# EAGLE design left_revision1_0 (EAGLE 7.2.0)
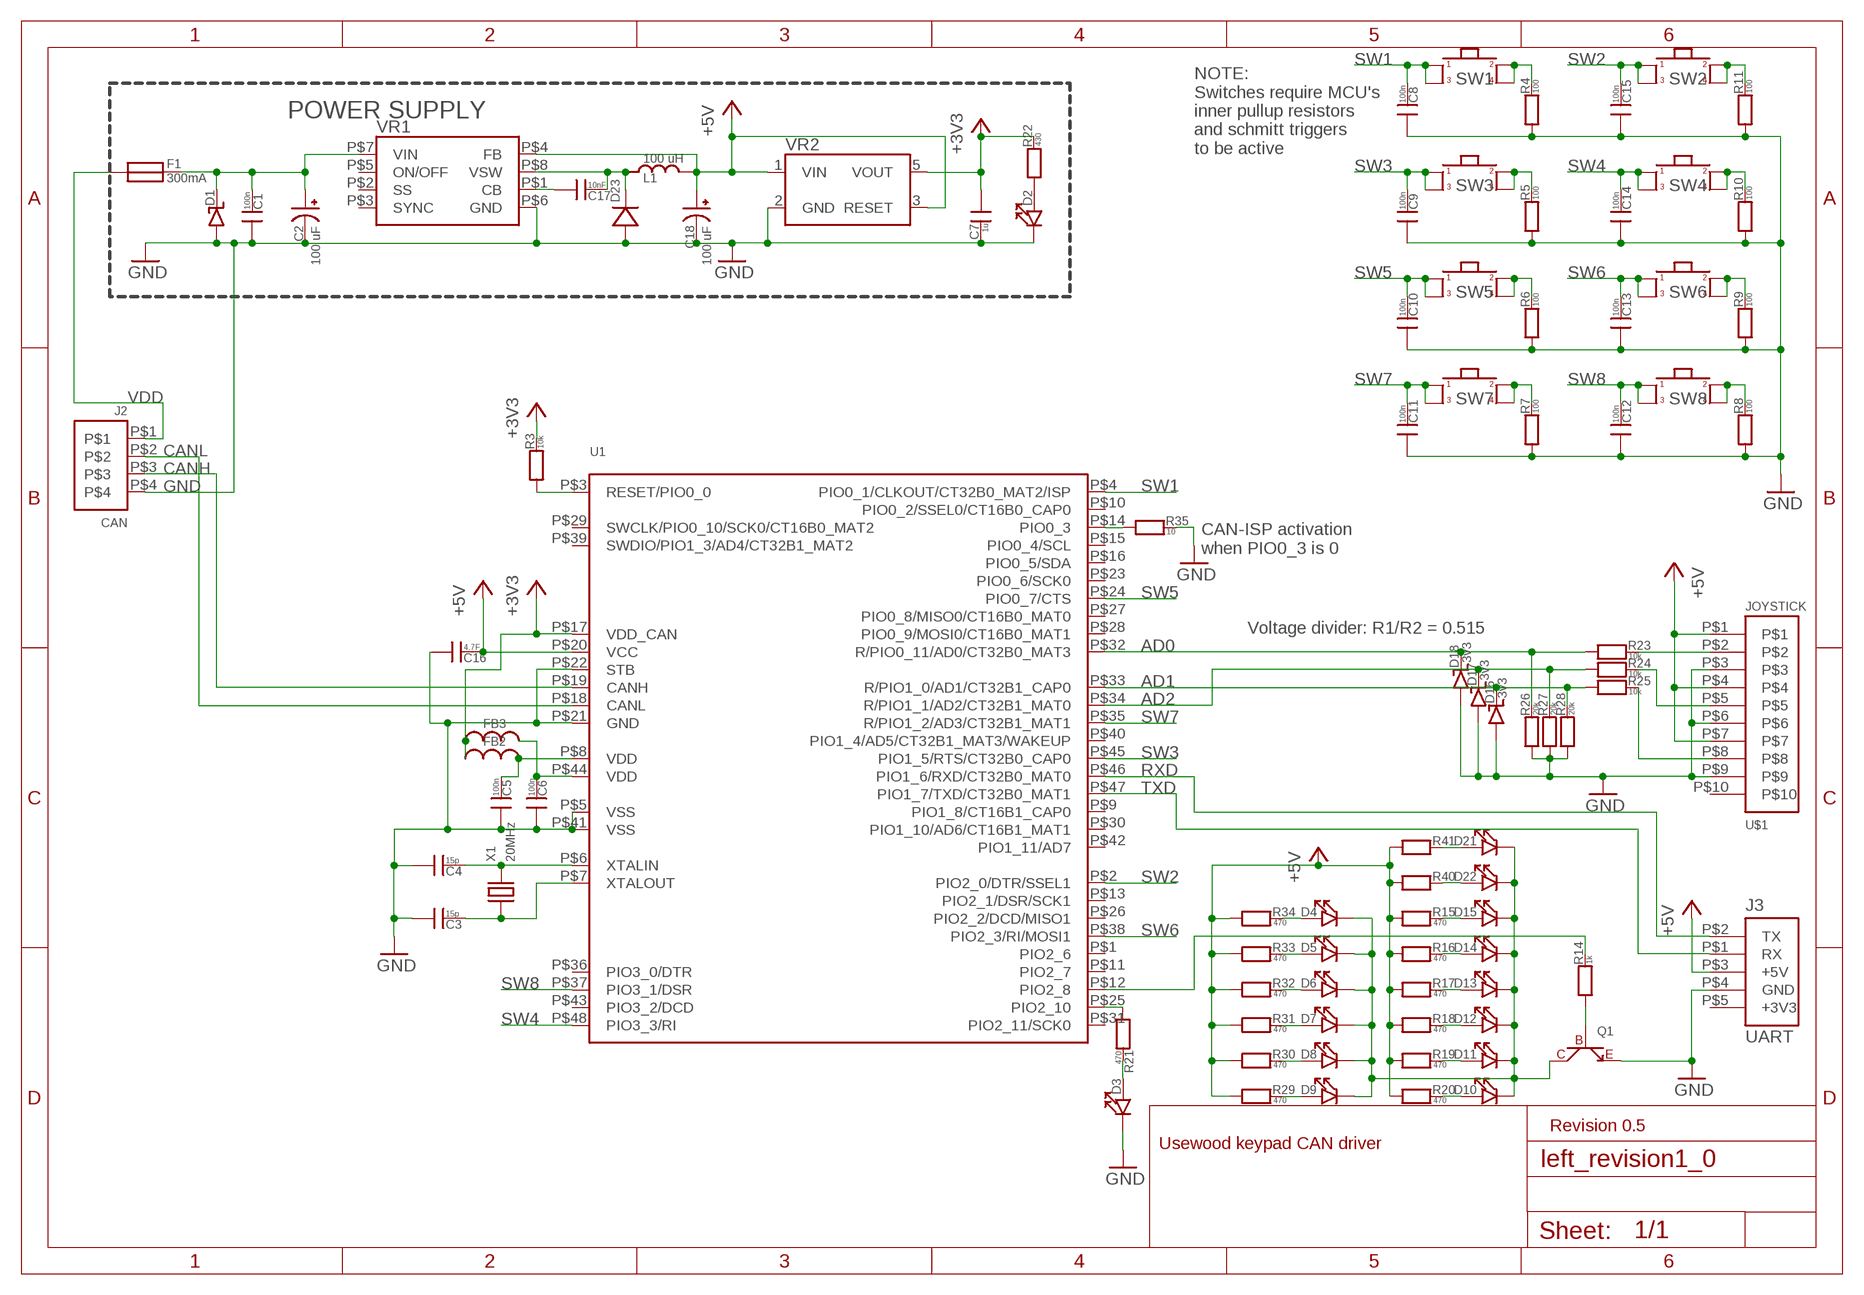
[diagram p0: schematic, sheet 1]

## Parts
C1  100n  CAP0603_SILKSCREEN  [0603_SILKSCREEN]
C2  100 uF  CAP_POLSMD_10X10X10MM  [CAP_POL_SMD_10X10X10MM]
C3  15p  CAP0603_SILKSCREEN  [0603_SILKSCREEN]
C4  15p  CAP0603_SILKSCREEN  [0603_SILKSCREEN]
C5  100n  CAP0603_SILKSCREEN  [0603_SILKSCREEN]
C6  100n  CAP0603_SILKSCREEN  [0603_SILKSCREEN]
C7  1u  CAP0603_SILKSCREEN  [0603_SILKSCREEN]
C8  100n  CAP0603_SILKSCREEN  [0603_SILKSCREEN]
C9  100n  CAP0603_SILKSCREEN  [0603_SILKSCREEN]
C10  100n  CAP0603_SILKSCREEN  [0603_SILKSCREEN]
C11  100n  CAP0603_SILKSCREEN  [0603_SILKSCREEN]
C12  100n  CAP0603_SILKSCREEN  [0603_SILKSCREEN]
C13  100n  CAP0603_SILKSCREEN  [0603_SILKSCREEN]
C14  100n  CAP0603_SILKSCREEN  [0603_SILKSCREEN]
C15  100n  CAP0603_SILKSCREEN  [0603_SILKSCREEN]
C16  4.7F  CAP0603_SILKSCREEN  [0603_SILKSCREEN]
C17  10nF  CAP0603_SILKSCREEN  [0603_SILKSCREEN]
C18  100 uF  CAP_POLSMD_10X10X10MM  [CAP_POL_SMD_10X10X10MM]
D1  DIODE_TVSDO-214AA  [DO-214AB]
D2  LED0603_SILKSCREEN  [0603_SILKSCREEN]
D3  LED0603_SILKSCREEN  [0603_SILKSCREEN]
D4  LED0603_SILKSCREEN  [0603_SILKSCREEN]
D5  LED0603_SILKSCREEN  [0603_SILKSCREEN]
D6  LED0603_SILKSCREEN  [0603_SILKSCREEN]
D7  LED0603_SILKSCREEN  [0603_SILKSCREEN]
D8  LED0603_SILKSCREEN  [0603_SILKSCREEN]
D9  LED0603_SILKSCREEN  [0603_SILKSCREEN]
D10  LED0603_SILKSCREEN  [0603_SILKSCREEN]
D11  LED0603_SILKSCREEN  [0603_SILKSCREEN]
D12  LED0603_SILKSCREEN  [0603_SILKSCREEN]
D13  LED0603_SILKSCREEN  [0603_SILKSCREEN]
D14  LED0603_SILKSCREEN  [0603_SILKSCREEN]
D15  LED0603_SILKSCREEN  [0603_SILKSCREEN]
D16  3v3  DIODE_ZENERSDO123  [SOD123]
D17  3v3  DIODE_ZENERSDO123  [SOD123]
D18  3v3  DIODE_ZENERSDO123  [SOD123]
D21  LED0603_SILKSCREEN  [0603_SILKSCREEN]
D22  LED0603_SILKSCREEN  [0603_SILKSCREEN]
D23  DIODEDO219AB  [DO219AB]
F1  300mA  FUSE100MA  [FUSE_100MA]
FB2  FERRITE0603_SILKSCREEN  [0603_SILKSCREEN]
FB3  FERRITE0603_SILKSCREEN  [0603_SILKSCREEN]
J2  CAN  MOLEX_MICRO-FIT_4WAYTH  [MOLEX_MICRO-FIT_4WAY]
J3  UART  HEADER_USARTTH  [HEADER5_1]
L1  100 uH  INDUCTORBOURNS_10X13X5MM  [INDUCTOR_BOURNS_10X13X5MM]
Q1  NPN_TRANSISTORSOT323  [SOT323]
R3  10k  RES0604_SILKSCREEN  [0603_SILKSCREEN]
R4  100  RES0604_SILKSCREEN  [0603_SILKSCREEN]
R5  100  RES0604_SILKSCREEN  [0603_SILKSCREEN]
R6  100  RES0604_SILKSCREEN  [0603_SILKSCREEN]
R7  100  RES0604_SILKSCREEN  [0603_SILKSCREEN]
R8  100  RES0604_SILKSCREEN  [0603_SILKSCREEN]
R9  100  RES0604_SILKSCREEN  [0603_SILKSCREEN]
R10  100  RES0604_SILKSCREEN  [0603_SILKSCREEN]
R11  100  RES0604_SILKSCREEN  [0603_SILKSCREEN]
R14  1k  RES0604_SILKSCREEN  [0603_SILKSCREEN]
R15  470  RES0604_SILKSCREEN  [0603_SILKSCREEN]
R16  470  RES0604_SILKSCREEN  [0603_SILKSCREEN]
R17  470  RES0604_SILKSCREEN  [0603_SILKSCREEN]
R18  470  RES0604_SILKSCREEN  [0603_SILKSCREEN]
R19  470  RES0604_SILKSCREEN  [0603_SILKSCREEN]
R20  470  RES0604_SILKSCREEN  [0603_SILKSCREEN]
R21  470  RES0604_SILKSCREEN  [0603_SILKSCREEN]
R22  430  RES0604_SILKSCREEN  [0603_SILKSCREEN]
R23  10k  RES0604_SILKSCREEN  [0603_SILKSCREEN]
R24  10k  RES0604_SILKSCREEN  [0603_SILKSCREEN]
R25  10k  RES0604_SILKSCREEN  [0603_SILKSCREEN]
R26  20k  RES0604_SILKSCREEN  [0603_SILKSCREEN]
R27  20k  RES0604_SILKSCREEN  [0603_SILKSCREEN]
R28  20k  RES0604_SILKSCREEN  [0603_SILKSCREEN]
R29  470  RES0604_SILKSCREEN  [0603_SILKSCREEN]
R30  470  RES0604_SILKSCREEN  [0603_SILKSCREEN]
R31  470  RES0604_SILKSCREEN  [0603_SILKSCREEN]
R32  470  RES0604_SILKSCREEN  [0603_SILKSCREEN]
R33  470  RES0604_SILKSCREEN  [0603_SILKSCREEN]
R34  470  RES0604_SILKSCREEN  [0603_SILKSCREEN]
R35  10  RES0604_SILKSCREEN  [0603_SILKSCREEN]
R40  RES0604_SILKSCREEN  [0603_SILKSCREEN]
R41  RES0604_SILKSCREEN  [0603_SILKSCREEN]
SW1  SWITCH12X12MM_CENTER_HOLE  [SWITCH_12X12MM_CENTER_HOLE]
SW2  SWITCH12X12MM_CENTER_HOLE  [SWITCH_12X12MM_CENTER_HOLE]
SW3  SWITCH12X12MM_CENTER_HOLE  [SWITCH_12X12MM_CENTER_HOLE]
SW4  SWITCH12X12MM_CENTER_HOLE  [SWITCH_12X12MM_CENTER_HOLE]
SW5  SWITCH12X12MM_CENTER_HOLE  [SWITCH_12X12MM_CENTER_HOLE]
SW6  SWITCH12X12MM_CENTER_HOLE  [SWITCH_12X12MM_CENTER_HOLE]
SW7  SWITCH12X12MM_CENTER_HOLE  [SWITCH_12X12MM_CENTER_HOLE]
SW8  SWITCH12X12MM_CENTER_HOLE  [SWITCH_12X12MM_CENTER_HOLE]
U1  LPC11C22QFP48  [QFP48]
U$1  JOYSTICK  MOLEX_MICRO-FIT_10WAYTH  [MOLEX-MICRO-FIT_10WAY]
VR1  LM2671SOIC8  [SOIC8]
VR2  LP2985SOP5  [SOP5]
X1  20MHz  XTALSMD_5X3.2  [XTAL_SMD_5X3.2]

## Nets
+3V3: C7.0 FB2.0 FB3.0 R3.1 R22.1 U1.P$17(VDD_CAN) VR2.5(VOUT)
+5V: C16.1 C18.+ J3.P$3(+5V) L1.P$2 R15.0 R16.0 R17.0 R18.0 R19.0 R20.0 R29.0 R30.0 R31.0 R32.0 R33.0 R34.0 R40.0 R41.0 U1.P$20(VCC) U$1.P$1 U$1.P$4 U$1.P$7 VR1.P$4(FB) VR2.1(VIN) VR2.3(RESET)
AD0: D18.P$2(N) R23.0 R26.1 U1.P$32(R/PIO0_11/AD0/CT32B0_MAT3)
AD1: D16.P$2(N) R25.0 R28.1 U1.P$33(R/PIO1_0/AD1/CT32B1_CAP0)
AD2: D17.P$2(N) R24.0 R27.1 U1.P$34(R/PIO1_1/AD2/CT32B1_MAT0)
CAN_ISP: R35.0 U1.P$14(PIO0_3)
CANH: J2.P$3 U1.P$19(CANH)
CANL: J2.P$2 U1.P$18(CANL)
GND: C1.0 C2.- C3.0 C4.0 C5.0 C6.0 C7.1 C8.0 C9.0 C10.0 C11.0 C12.0 C13.0 C14.0 C15.0 C16.0 C18.- D1.P$1(P) D2.1 D3.1 D16.P$1(P) D17.P$1(P) D18.P$1(P) D23.P$1(P) J2.P$4 J3.P$4(GND) Q1.R(E) R4.0 R5.0 R6.0 R7.0 R8.0 R9.0 R10.0 R11.0 R26.0 R27.0 R28.0 R35.1 U1.P$5(VSS) U1.P$21(GND) U1.P$22(STB) U1.P$41(VSS) U$1.P$3 U$1.P$6 U$1.P$9 VR1.P$6(GND) VR2.2(GND)
LED3: D3.0 R21.1
LED4: D4.0 R34.1
LED5: D5.0 R33.1
LED6: D6.0 R32.1
LED7: D7.0 R31.1
LED8: D8.0 R30.1
LED9: D9.0 R29.1
N$2: C6.1 FB3.1 U1.P$44(VDD)
N$3: D2.0 R22.0
N$4: C1.1 C2.+ D1.P$2(N) F1.P$2 VR1.P$7(VIN)
N$5: R14.1 U1.P$12(PIO2_8)
N$6: R21.0 U1.P$25(PIO2_10)
N$11: C17.1 D23.P$2(N) L1.P$1 VR1.P$8(VSW)
N$12: R4.1 SW1.P$3 SW1.P$4
N$13: R5.1 SW3.P$3 SW3.P$4
N$14: R6.1 SW5.P$3 SW5.P$4
N$15: R11.1 SW2.P$3 SW2.P$4
N$16: R9.1 SW6.P$3 SW6.P$4
N$17: R10.1 SW4.P$3 SW4.P$4
N$18: R8.1 SW8.P$3 SW8.P$4
N$19: R7.1 SW7.P$3 SW7.P$4
N$20: D15.0 R15.1
N$21: D14.0 R16.1
N$22: D13.0 R17.1
N$23: D12.0 R18.1
N$24: D11.0 R19.1
N$25: D10.0 R20.1
N$26: C5.1 FB2.1 U1.P$8(VDD)
N$29: D21.0 R41.1
N$30: D22.0 R40.1
N$31: D4.1 D5.1 D6.1 D7.1 D8.1 D9.1 D10.1 D11.1 D12.1 D13.1 D14.1 D15.1 D21.1 D22.1 Q1.M(C)
N$32: C17.0 VR1.P$1(CB)
Q1: Q1.L(B) R14.0
RESET: R3.0 U1.P$3(RESET/PIO0_0)
RXD: J3.P$2(TX) U1.P$46(PIO1_6/RXD/CT32B0_MAT0)
SW1: C8.1 SW1.P$1 SW1.P$2 U1.P$4(PIO0_1/CLKOUT/CT32B0_MAT2/ISP)
SW2: C15.1 SW2.P$1 SW2.P$2 U1.P$2(PIO2_0/DTR/SSEL1)
SW3: C9.1 SW3.P$1 SW3.P$2 U1.P$45(PIO1_5/RTS/CT32B0_CAP0)
SW4: C14.1 SW4.P$1 SW4.P$2 U1.P$48(PIO3_3/RI)
SW5: C10.1 SW5.P$1 SW5.P$2 U1.P$24(PIO0_7/CTS)
SW6: C13.1 SW6.P$1 SW6.P$2 U1.P$38(PIO2_3/RI/MOSI1)
SW7: C11.1 SW7.P$1 SW7.P$2 U1.P$35(R/PIO1_2/AD3/CT32B1_MAT1)
SW8: C12.1 SW8.P$1 SW8.P$2 U1.P$37(PIO3_1/DSR)
TXD: J3.P$1(RX) U1.P$47(PIO1_7/TXD/CT32B0_MAT1)
VDD: F1.P$1 J2.P$1
XJOY: R23.1 U$1.P$2
XTALIN: C4.1 U1.P$6(XTALIN) X1.P$2
XTALOUT: C3.1 U1.P$7(XTALOUT) X1.P$1
YJOY: R24.1 U$1.P$5
ZJOY: R25.1 U$1.P$8
Unconnected: J3.P$5(+3V3) U1.P$1(PIO2_6) U1.P$9(PIO1_8/CT16B1_CAP0) U1.P$10(PIO0_2/SSEL0/CT16B0_CAP0) U1.P$11(PIO2_7) U1.P$13(PIO2_1/DSR/SCK1) U1.P$15(PIO0_4/SCL) U1.P$16(PIO0_5/SDA) U1.P$23(PIO0_6/SCK0) U1.P$26(PIO2_2/DCD/MISO1) U1.P$27(PIO0_8/MISO0/CT16B0_MAT0) U1.P$28(PIO0_9/MOSI0/CT16B0_MAT1) U1.P$29(SWCLK/PIO0_10/SCK0/CT16B0_MAT2) U1.P$30(PIO1_10/AD6/CT16B1_MAT1) U1.P$31(PIO2_11/SCK0) U1.P$36(PIO3_0/DTR) U1.P$39(SWDIO/PIO1_3/AD4/CT32B1_MAT2) U1.P$40(PIO1_4/AD5/CT32B1_MAT3/WAKEUP) U1.P$42(PIO1_11/AD7) U1.P$43(PIO3_2/DCD) U$1.P$10 VR1.P$2(SS) VR1.P$3(SYNC) VR1.P$5(ON/OFF)

## Notes on the sheet
- POWER SUPPLY
- NOTE:
  Switches require MCU's
  inner pullup resistors
  and schmitt triggers
  to be active
- CAN-ISP activation 
  when PIO0_3 is 0
- Voltage divider: R1/R2 = 0.515
- Revision 0.5
- Usewood keypad CAN driver

## Library data of the parts
C1 C3-C17 = usevolt:CAP
C2 C18 = usevolt:CAP_POL
D1 = arm:DIODE_TVS
D2-D15 D21 D22 = usevolt:LED
D16-D18 = usevolt:DIODE_ZENER
D23 = usevolt:DIODE
F1 = arm:FUSE
FB2 FB3 = usevolt:FERRITE
J2 = arm:MOLEX_MICRO-FIT_4WAY: MOLEX 43045-0401 HEADER, RIGHT ANGLE, DUAL ROW, 4 WAY, 1704306
J3 = arm:HEADER_USART: USB to USART module header
L1 = usevolt:INDUCTOR
Q1 = usevolt:NPN_TRANSISTOR: http://www.farnell.com/datasheets/1697409.pdf 9294511
R3-R11 R14-R35 R40 R41 = usevolt:RES
SW1-SW8 = arm:SWITCH
U1 = arm:LPC11C22: NXP MCU, 32BIT, CORTEX-M0, 50MHZ, LQFP-48, 2314753
U$1 = usevolt:MOLEX_MICRO-FIT_10WAY: MOLEX HEADER, MICRO-FIT, R/A, DUAL ROW, 10 WAY, 1012255
VR1 = usevolt:LM2671
VR2 = arm:LP2985: TEXAS INSTRUMENTS LP2985IM5-3.3 V REG LDO +3.3V, SMD, 2985, SOT235
X1 = arm:XTAL

## Board
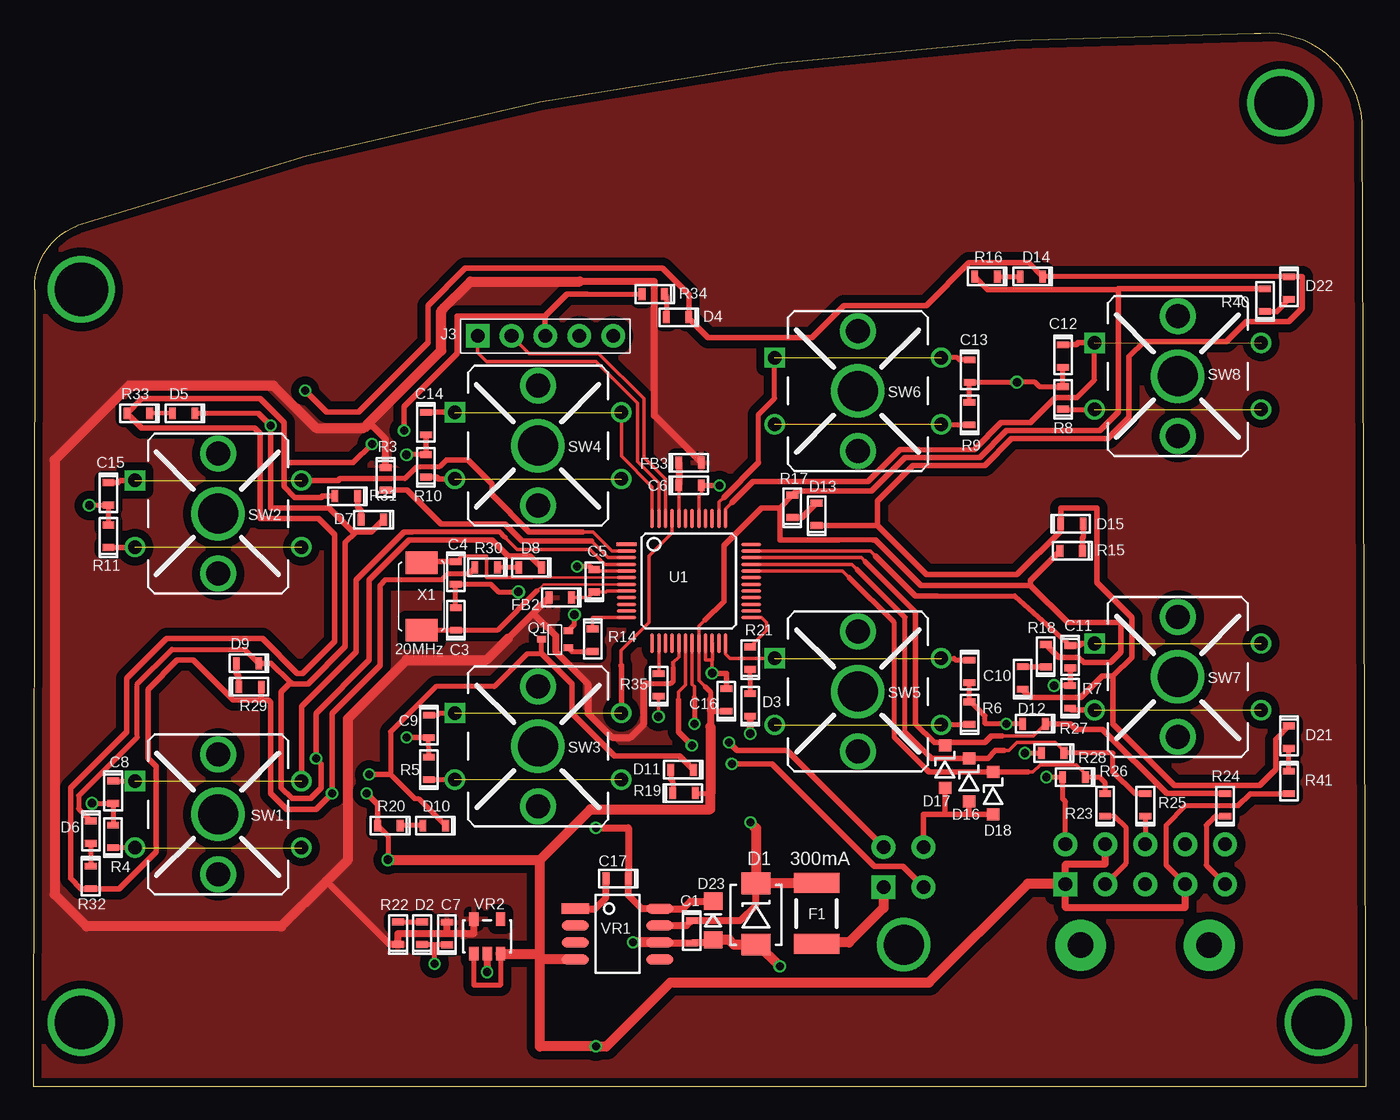
[diagram p1: board, top side]
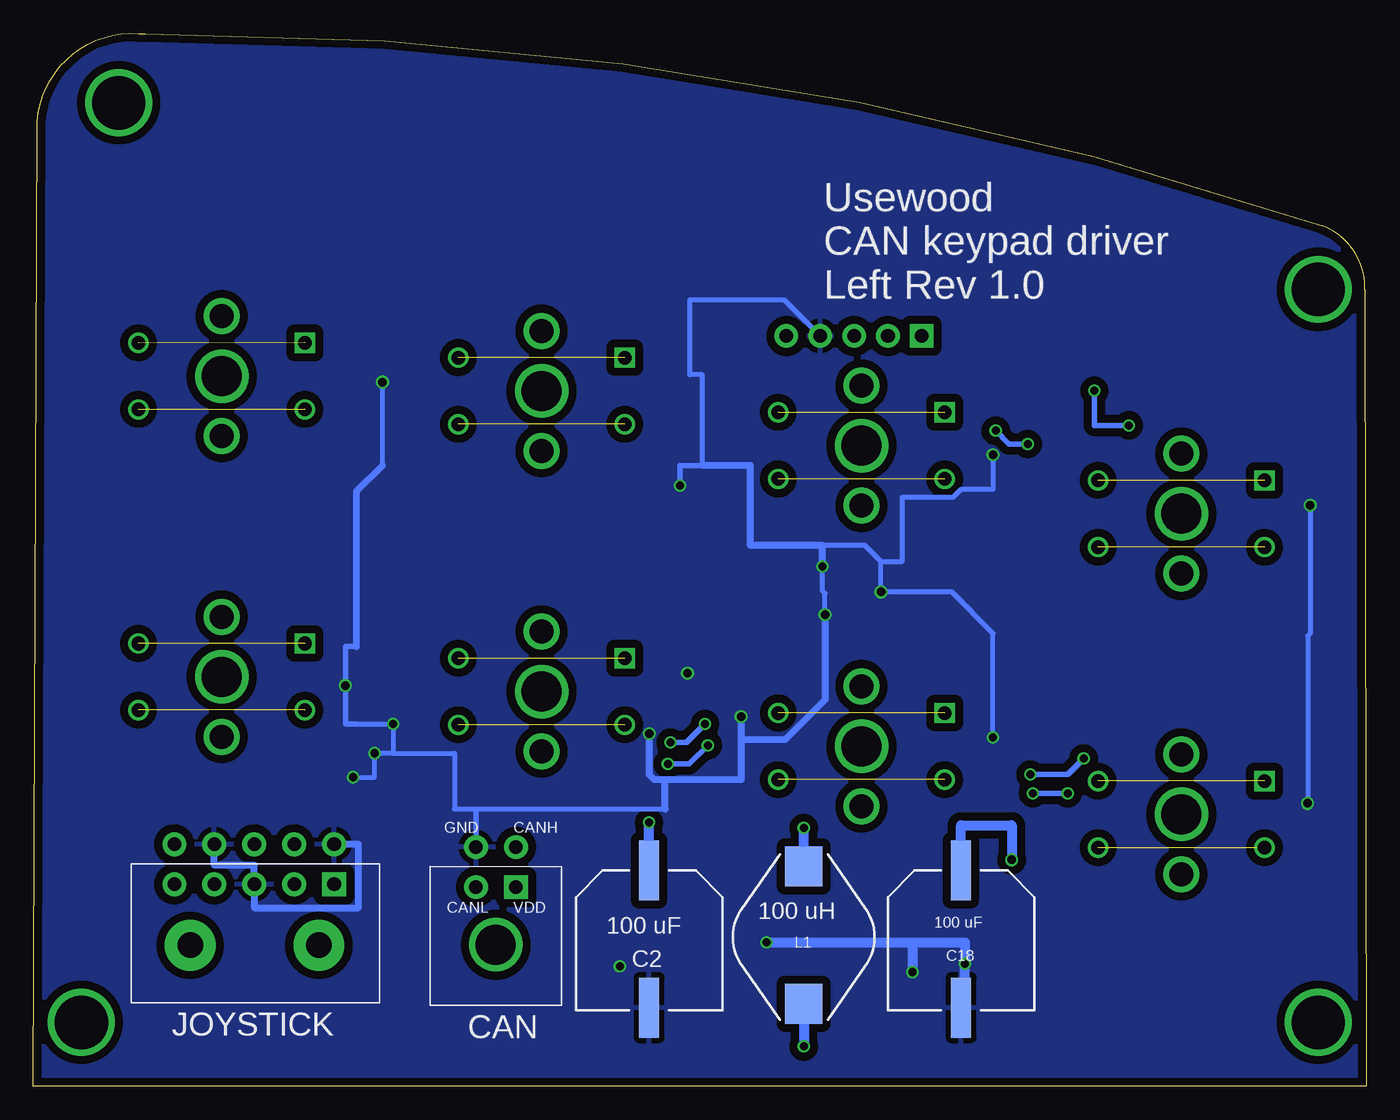
[diagram p2: board, bottom side, seen from below]

Size 100 x 79.02 mm. Coordinates in mm from the lower left corner, seen from the top.
Outline: 100,0 99.7,72.4 arc90 92.1,79 91.6,79 arc19 3.3,64.6 arc71 0.1,59.8 0,0 100,0
Copper layers (1*16): Top 0.035mm / dielectric 1.5mm / Bottom 0.035mm
Design rules "SeeedStudio_2layer_DRU_no_angle_20140221 *": minimum track width 6mil, minimum drill 12mil, track to track 6mil, track to pad 6mil, pad to pad 6mil, via to via 6mil, smd to smd 0mil, copper to edge 10mil, drill to drill 10mil, minimum pad ring 10mil, minimum via ring 6mil, stop-mask expansion 2mil, vias tented up to drill 100mil, thermal gap 16mil

### Footprints (pad centres in the part's own frame; a part is rotated, then mirrored left to right if it is on the bottom)
0603_SILKSCREEN = smd 0.508 x 0.889: 0 -1.041,0; 1 0.648,0
CAP_POL_SMD_10X10X10MM = smd 1.5 x 4.5: + 0,0; - 0,10.3
DO-214AB = smd 1.62 x 2.18: P$1 0,0; P$2 4.6,0
SOD123 = smd 0.9 x 0.95: P$1 0,0; P$2 3.2,0
DO219AB = smd 1.3 x 1.4: P$1 0,0; P$2 2.9,0
FUSE_100MA = smd 1.5 x 3.41: P$1 0,0; P$2 4.572,0
MOLEX_MICRO-FIT_4WAY = drill 1.016 pad 1.778 square: P$1 1.27,2.032 | drill 1.016 pad 1.778: P$2 -1.727,2.032; P$3 1.27,5.029; P$4 -1.727,5.029 | drill 3: P$5 -0.25,-2.3
HEADER5_1 = drill 1.016 pad 1.778 square: P$1 0,0 | drill 1.016 pad 1.778: P$2 0,-2.54; P$3 0,-5.08; P$4 0,-7.62; P$5 0,-10.16
INDUCTOR_BOURNS_10X13X5MM = smd 3 x 2.8: P$1 -1.5,0; P$2 8.8,0
SOT323 = smd 0.5 x 0.7: L 0,0; M 0.63,2; R 1.27,0
SWITCH_12X12MM_CENTER_HOLE = drill 1.016 square: P$1 -3,4.75 | drill 1.016: P$2 9.5,4.75; P$3 -3,-0.25; P$4 9.5,-0.25 | drill 3 pad 2.9: P$5 3.25,2.25 | drill 1.8 pad 1.7: P$10 3.25,6.75; P$11 3.25,-2.25
QFP48 = smd 1.5 x 0.28: P$1 0.2,0; P$2 0.2,-0.5; P$3 0.2,-1; P$4 0.2,-1.5; P$5 0.2,-2; P$6 0.2,-2.5; P$7 0.2,-3; P$8 0.2,-3.5; P$9 0.2,-4; P$10 0.2,-4.5; P$11 0.2,-5; P$12 0.2,-5.5; P$25 9.55,-5.5; P$26 9.55,-5; P$27 9.55,-4.5; P$28 9.55,-4; P$29 9.55,-3.5; P$30 9.55,-3; P$31 9.55,-2.5; P$32 9.55,-2; P$33 9.55,-1.5; P$34 9.55,-1; P$35 9.55,-0.5; P$36 9.55,0 | smd 0.28 x 1.5: P$13 2.125,-7.425; P$14 2.625,-7.425; P$15 3.125,-7.425; P$16 3.625,-7.425; P$17 4.125,-7.425; P$18 4.625,-7.425; P$19 5.125,-7.425; P$20 5.625,-7.425; P$21 6.125,-7.425; P$22 6.625,-7.425; P$23 7.125,-7.425; P$24 7.625,-7.425; P$37 7.625,1.925; P$38 7.125,1.925; P$39 6.625,1.925; P$40 6.125,1.925; P$41 5.625,1.925; P$42 5.125,1.925; P$43 4.625,1.925; P$44 4.125,1.925; P$45 3.625,1.925; P$46 3.125,1.925; P$47 2.625,1.925; P$48 2.125,1.925
MOLEX-MICRO-FIT_10WAY = drill 1.016 pad 1.778 square: P$1 0,-0.508 | drill 1.016 pad 1.778: P$2 -2.997,-0.508; P$3 -5.994,-0.508; P$4 -8.992,-0.508; P$5 -11.989,-0.508; P$6 0,2.489; P$7 -2.997,2.489; P$8 -5.994,2.489; P$9 -8.992,2.489; P$10 -11.989,2.489 | drill 1.905 pad 3.81: P$11 -10.795,-5.08; P$12 -1.143,-5.08
SOIC8 = smd 2.032 x 0.762: P$1 -2.54,2.54; P$2 -2.54,1.27; P$3 -2.54,0; P$4 -2.54,-1.27; P$5 3.81,-1.27; P$6 3.81,0; P$7 3.81,1.27; P$8 3.81,2.54
SOP5 = smd 0.7 x 1: 1 -1,0; 2 0,0; 3 1,0; 4 1,2.6; 5 -1,2.6
XTAL_SMD_5X3.2 = smd 1.7 x 2.4: P$1 -2.54,0; P$2 2.54,0

### Placement (x,y rotation side)
C1  49.4,11.8 90 top
C2  53.8,16.2 180 bottom
C3  31.7,34.87 270 top
C4  31.69,38.73 90 top
C5  42.09,37.75 270 top
C6  49.07,45.1 180 top
C7  31.04,11.28 270 top
C8  6,22.27 90 top
C9  29.67,27.21 90 top
C10  70.24,31.33 90 top
C11  77.8,32.43 90 top
C12  77.25,54.99 90 top
C13  70.25,53.87 90 top
C14  29.46,49.93 90 top
C15  5.63,44.65 90 top
C16  52,28.8 270 top
C17  44,15.6 0 top
C18  30.4,16.2 180 bottom
D1  54.22,10.64 90 top
D2  29.17,11.3 270 top
D3  53.79,28.43 270 top
D4  48.53,57.71 0 top
D5  11.47,50.5 0 top
D6  4.32,19.27 90 top
D7  25.63,42.53 0 top
D8  37.47,38.94 0 top
D9  16.27,31.74 0 top
D10  30.27,19.57 0 top
D11  48.87,23.75 0 top
D12  74.22,30.45 270 top
D13  58.77,42.73 270 top
D14  75.07,60.77 0 top
D15  77.73,42.22 180 top
D16  70.2,21.4 90 top
D17  68.4,22.4 90 top
D18  72,20.4 90 top
D21  94.2,26.4 90 top
D22  94.2,60.1 90 top
D23  51,11 90 top
F1  58.77,10.69 90 top
FB2  39.73,36.68 0 top
FB3  49.08,46.8 180 top
J2  65.06,12.93 0 bottom
J3  33.34,56.31 90 top
L1  42.2,15 270 bottom
Q1  40.13,32.92 90 top
R3  26.43,45.79 90 top
R4  5.97,18.57 270 top
R5  29.68,23.67 270 top
R6  70.24,27.81 270 top
R7  77.79,29.03 270 top
R8  77.26,51.47 270 top
R9  70.24,50.29 270 top
R10  29.45,46.37 270 top
R11  5.63,41.09 270 top
R14  41.97,33.67 90 top
R15  78.05,40.18 0 top
R16  71.67,60.77 0 top
R17  56.95,43.33 270 top
R18  75.96,32.13 270 top
R19  48.63,22.02 180 top
R20  26.87,19.57 0 top
R21  53.78,31.93 270 top
R22  27.37,11.3 270 top
R23  80.42,20.93 270 top
R24  89.42,20.93 270 top
R25  83.43,20.93 270 top
R26  78.27,23.2 0 top
R27  75.27,27.2 0 top
R28  76.67,25.01 0 top
R29  16.07,29.98 180 top
R30  34.17,38.94 0 top
R31  23.67,44.29 0 top
R32  4.31,15.87 90 top
R33  8.07,50.5 0 top
R34  46.71,59.45 0 top
R35  46.92,29.93 270 top
R40  92.4,58.8 270 top
R41  94.2,23 90 top
SW1  10.61,18.16 0 top
SW2  10.61,40.72 0 top
SW3  34.61,23.27 0 top
SW4  34.61,45.82 0 top
SW5  58.61,27.38 0 top
SW6  58.61,49.93 0 top
SW7  82.61,28.49 0 top
SW8  82.61,51.04 0 top
U1  44.31,40.68 0 top
U$1  77.43,15.67 0 bottom
VR1  43.2,10.8 0 top
VR2  34.05,9.96 0 top
X1  29.12,36.76 90 top

### Tracks (layer width: path | path; a pad name or v marks a point on that pad's centre or on a via)
+3V3
  Top 0.254: U1.P$17 48.44,32.24 48,31.8 48,31.4
  Top 0.381: 48,31.4 48,30.4 47.8,30.2 46,30.2
  Top 0.508: 33,12.56 VR2.5 33.05,11.48 31,11.48 | 35.6,33.6 37.5,35.5 | 37.5,35.5 FB2.0 | 41,60.4 46.6,60.4 46.6,50.32 FB3.0 | 37.5,35.5 39.2,33.8 39.2,32.6 41.6,30.2 41.6,28 43.4,26.2 44.8,26.2 45.8,27.2 45.8,30 46,30.2 | 22,15.4 26.75,10.65 R22.1 27.37,11.48 31,11.48 | C7.0 31,12.32 31,11.48 | R3.1 26.43,48.57 25.2,49.8
  Top 0.762: 35.6,33.6 34,32 28,32 23.6,27.6 23.6,17 22,15.4 18.6,12 4,12 1.6,14.4 1.6,47 7.2,52.6 18,52.6 21.2,49.4 24.8,49.4 25.2,49.8 30.6,55.2 30.6,58.2 32.8,60.4 41,60.4
  pour Top (isolate 0.61): 0,0 0.2,59.8 arc-41 0.8,62.2 arc-28 2.6,64.2 arc-9 11.4,67.2 arc1 28.4,71.6 arc-5 45.2,75.2 arc-6 73.2,78.4 arc-3 90,79 arc-1 92.4,79 arc-15 93.8,78.8 arc-5 96.2,78 arc-27 98.2,76 arc-39 99.6,72.4 100,0
+5V  (via drill 0.6, 0.64)
  Top 0.254: 50.4,30 49.94,30.46 U1.P$20 49.94,34.54 50.4,35
  Top 0.381: VR2.3 35.05,7.6 33.05,7.6 VR2.1 | 86.4,15.17 U$1.P$4 85,16.59 85,19.6 86.48,21.08 90.42,21.08 | 50.4,30 50.8,29.6 50.8,29 | v26.6,17 26.6,18.8 R20.0 | 26.4,38 30.6,38 31.1,38.5 32.69,38.5 R30.0 | 63,41 60.4,41 | 41.56,59.45 R34.0 | 70.63,60.75 R16.0 | R19.0 49.68,22 50.8,22
  Top 0.406: R18.0 76.92,32.2 78.4,32.2 78.8,31.8 80.8,31.8 81.6,32.6 81.6,34.8 77.6,34.8 74.8,37.6 | 60.4,41 56,41 56,43.41 | 56,43.41 R17.0 57.27,44.68 62.88,44.68 65.4,47.2 71,47.2 73,49.2 80,49.2 81.4,50.6 81.4,59.8 | C16.1 50.8,28.15 50.8,28.2 | 63,41 63.2,41 66.6,37.6 74.8,37.6 | R15.0 74.8,37.97 74.8,37.6 | 90.42,21.08 91.3,21.96 R41.0 | R40.0 81.4,59.84 81.4,59.8 | 70.63,60.75 71.58,59.8 81.4,59.8 | 26.4,38 26,37.6 26,31.6 22.4,28 v22.4,22 21.2,20.8 19,20.8 17.8,22 17.8,28.8 17.6,29 17.2,29 | 17.2,29 15,29 12,32 10.8,32 8.6,29.8 8.6,24.6 9.2,24 9.2,17.6 6.43,14.83 R32.0 3.57,14.83 2.8,15.6 2.8,22.4 7,26.6 7,30.6 10,33.6 17.2,33.6 19.8,31 20.2,31 22.6,33.4 22.6,41.4 21.4,42.6 17,42.6 17,49 16.6,49.4 8.13,49.4 R33.0 8.13,51.6 17,51.6 18.8,49.8 18.8,46.8 | R29.0 17.11,29.09 17.2,29 | R20.0 25.83,21.17 v25,22 | R31.0 21.69,44.29 21.6,44.2 19.6,44.2 18.8,45 18.8,46.8 | 18.8,46.8 24,46.8 v25.4,48.2 | v27.8,49.2 27.8,51 31.8,55 31.8,57.8 38.4,57.8 | 38.4,57.8 38.4,56.33 J3.P$3 | 41.56,59.45 40.05,59.45 38.4,57.8 | 50.4,35 51.8,36.4 51.8,40.6 54.62,43.41 56,43.41
  Top 0.508: VR2.3 35.05,10 | U$1.P$7 80.43,16.68 77.43,16.68 U$1.P$1 77.43,13.4 86.4,13.4 86.4,15.17 | 50.8,29 50.8,28.2 50.8,27 | 37.93,9.6 38,9.53
  Top 0.762: v26.6,17 38,17 | U$1.P$1 77.4,15.2 74.6,15.2 67.2,7.8 47.8,7.8 43,3 v42.2,3 38,3 38,9.53 | 50.8,27 50.8,22 50.8,20.8 41.8,20.8 38,17 | 38,9.53 38,9.96 | 38,9.96 38,17 | VR1.P$4 38,9.53 | VR2.3 38,9.96
  Bottom 0.406: v25,22 v22.4,22 | v25.4,48.2 26.8,48.2 v27.8,49.2
  Bottom 0.762: L1.P$2 v42.2,3 | C18.+ 30.4,19.6 26.6,19.6 v26.6,17
AD0
  Top 0.254: R26.1 79.07,23.31 78.24,24.14 75.54,24.14 75,23.6 74.6,23.6 | 61.2,38.2 60.72,38.68 U1.P$32
  Top 0.381: R23.0 80.42,22.78 80,23.2 79.08,23.2 R26.1 | 67,23.8 64.6,26.2 64.6,34.8 61.2,38.2
  Top 0.406: 67,23.8 67.2,23.6 D18.P$2 74.6,23.6
AD1
  Top 0.254: U1.P$33 61.42,39.18 61.8,38.8 | R28.1 77.32,25.16 76.68,25.8 73.8,25.8 73.2,25.2 72.8,25.2
  Top 0.381: 81,23.6 81,25.01 R28.1 | 67.2,24.8 65.4,26.6 65.4,35.2 61.8,38.8
  Top 0.406: 72.8,25.2 72.2,25.2 71.6,24.6 D16.P$2 67.4,24.6 67.2,24.8 | 81,23.6 82.63,21.97 R25.0
AD2
  Top 0.254: 62.4,39.4 62.12,39.68 U1.P$34 | R27.1 75.02,26.3 72.68,26.3 | D17.P$2 68.4,25.8
  Top 0.381: 66.2,35.6 62.4,39.4
  Top 0.406: R27.1 77.8,27.2 78.2,26.8 80.2,26.8 85.03,21.97 R24.0 | 66.2,35.6 66.2,27.2 67.6,25.8 68.4,25.8 71.4,25.8 71.9,26.3 72.68,26.3
CAN_ISP
  Top 0.254: R35.0 46.94,30.99 U1.P$14
CANH  (via drill 0.6)
  Top 0.254: U1.P$19 49.44,30.16 49.6,30 49.6,29.2
  Top 0.381: 49.6,29.2 v49.6,27.2
  Top 0.406: v52.2,25.8 52.8,25.2 56.54,25.2 J2.P$3
  Bottom 0.406: v49.6,27.2 51,25.8 v52.2,25.8
CANL  (via drill 0.6)
  Top 0.254: U1.P$18 48.94,30.14 48.4,29.6 48.4,29
  Top 0.406: 48.4,29 48.4,26.6 v49.4,25.6 | v52.4,24.2 55.4,24.2 63.1,16.5 65.24,16.5 J2.P$2
  Bottom 0.406: v49.4,25.6 50.8,24.2 v52.4,24.2
GND  (via drill 0.6, 0.61, 0.64)
  Top 0.254: U1.P$5 42.33,38.68 C5.0 | U1.P$41 49.94,44.34 50.11,44.51 C6.0 | v50.92,31 50.94,31.02 50.94,31.98 | U1.P$21 50.44,32 50.94,32 50.94,31.98 | v46.9,27.74 46.9,29.13 R35.1 | 50.94,31.98 50.94,33.22 U1.P$22
  Top 0.381: C5.0 41.81,38.99 v40.8,39 | R4.0 6,19.79 C8.0 5.99,21.24 v4.4,21.24 | R11.0 C15.0 4.2,43.61 v4.2,43.6 | R5.0 29.66,26.16 C9.0 | R9.0 C13.0 | C13.0 | C12.0 R8.0 75.49,52.51 75.16,52.84 v73.8,52.84 v73.8,52.83 C13.0 | 70.24,28.96 C10.0 | U$1.P$6 77.43,21.37 77.23,21.57 R26.0 v76,23.2 | R28.0 v74.4,25 | R27.0 v73,27.2 71.4,27.2 71.4,27.8 70.24,28.96 | R10.0 v28,47.41 v28,47.4 | 70.24,28.96 R6.0 | Q1.R 40.6,34.66 v40.6,35.4 | C7.1 30,10.63 | 30,10.63 29.19,10.63 D2.1 | v30.1,9.2 30.1,10.53 30,10.63 | C3.0 31.69,35.92 C4.0 34.31,37.69 34.9,37.1 v36.4,37.1
  Top 0.406: R10.0 C14.0 | C6.0 v51.48,45.1 | C11.0 R7.0 76.58,30.07 v76.58,30.08 | D18.P$1 70.2,20.4 | 70.2,20.4 68.4,20.4 | 68.4,20.4 66.78,20.4 J2.P$4 | D16.P$1 70.2,20.4 | D17.P$1 68.4,20.4 | C16.0 52,31 v50.92,31 | v28,26.17 C9.0
  Top 0.508: VR2.2 34.05,8.6 v34.04,8.58 | D3.1 53.78,27.62 v53.78,26.46 | D23.P$1 50.76,10.76 C1.0 47.05,10.76 VR1.P$6
  Top 0.762: D23.P$1 52.2,11 52.56,10.64 D1.P$1 54.36,10.64 v56,9 | VR1.P$6 v45,10.8
  Bottom 0.381: v34.04,8.58 34.04,8.6 | 73,25 v73,27.2 75.78,27.2 | 73,25 v74.4,25 74.4,23.2 v76,23.2 | 52.6,20.8 66.8,20.8 68.4,20.8 68.4,25 73,25 | v4.4,21.24 4.4,33.8 4.2,34 v4.2,43.6 | v28,26.17 28,34 31.1,37.1 v36.4,37.1 36.4,39.4 | 49.8,46.6 49.8,53.4 50.74,53.4 50.74,59 43.65,59 J3.P$4 | 75.78,34.2 75.78,33 | 73.8,46.6 v73.8,52.84 | v40.6,35.4 40.6,37 40.8,37.2 v40.8,39 | v28,47.4 28,44.8 30.4,44.8 31,44.2 34.8,44.2 34.8,39.4 36.4,39.4 | 36.4,39.4 37.6,40.6 40.8,40.6
  Bottom 0.406: v51.48,45.1 51.48,46.6 49.8,46.6 | 75.78,27.2 76.58,27.2 v76.58,30.08 76.58,33 75.78,33 | 66.8,20.8 66.8,18 66.78,18 J2.P$4
  Bottom 0.508: U$1.P$9 86.42,16.6 83.4,16.6 83.43,16.57 U$1.P$3 83.43,13.4 75.6,13.4 75.6,18.16 U$1.P$6 | v46.9,27.74 46.9,26 | 46.9,26 46.9,23 52.6,23 | 52.6,23 53.4,23 53.78,23.38 v53.78,26.46 | v40.8,39 40.8,40.6 46.2,40.6 46.2,46.6 49.8,46.6 | 73.8,46.6 75.78,44.62 75.78,33 | v40.6,35.4 40.6,29 43.6,26 46.9,26 | 52.6,20.8 52.6,23
  Bottom 0.762: C18.- 30.1,5.9 v30.1,9.2 30.1,10.8 34.04,10.8 | v45,10.8 34.04,10.8 | 34.04,10.8 v34.04,8.58
  pour Bottom (isolate 0.61): 0,0 0.2,60 arc-41 0.8,62.2 arc-28 2.6,64.2 arc-9 11.4,67.2 arc1 28.4,71.6 arc-5 45.2,75.2 arc-6 73.2,78.4 arc-3 90,79 arc-1 92.4,79 arc-15 93.8,78.8 arc-5 96.2,78 arc-27 98.2,76 arc-39 99.6,72.4 100,0
LED3
  Top 0.381: D3.0 53.79,30.52 R21.1
LED4
  Top 0.381: R34.1 47.49,59.31 D4.0
LED5
  Top 0.381: D5.0 8.87,50.52 R33.1
LED6
  Top 0.381: D6.0 4.32,16.53 R32.1
LED7
  Top 0.406: D7.0 24.59,43.21 24.32,43.48 R31.1
LED8
  Top 0.381: D8.0 R30.1
LED9
  Top 0.406: D9.0 15.23,30.97 15.42,30.78 R29.1
N$2
  Top 0.254: U1.P$44 48.44,45.09 C6.1
  Top 0.508: FB3.1 48.43,45.11 C6.1
N$3
  Top 0.381: R22.0 D2.0
N$4  (via drill 0.6)
  Top 0.508: D1.P$2 54.2,15.21 54.2,13.6 53.05,12.45 C1.1 49.02,12.07 VR1.P$7
  Top 0.762: F1.P$2 58.74,15.24 D1.P$2 54.22,19.38 v53.8,19.8
  Bottom 0.762: C2.+ v53.8,19.8
N$5
  Top 0.254: U1.P$12 41.97,35.18 R14.1
N$6
  Top 0.254: U1.P$25 54.62,35.18 55,34.8 55,34.2 53.78,32.98 R21.0
N$7  (via drill 4)
  other vias: 96.4,4.8
N$8  (via drill 4)
  other vias: 3.6,4.8
N$9  (via drill 4)
  other vias: 3.6,59.8
N$10  (via drill 4)
  other vias: 93.6,73.8
N$11  (via drill 0.6)
  Top 0.508: D23.P$2 49.3,13.9 48.74,13.34 VR1.P$8 45.66,13.34 44.65,14.35 C17.1 44.65,19.4 v42.2,19.4
  Bottom 0.762: L1.P$1 v42.2,19.4
N$12  (1 unrouted)
  Top 0.381: SW1.P$3 8.2,17.91 8.19,17.92 R4.1
N$13  (1 unrouted)
  Top 0.381: R5.1 SW3.P$3
N$14  (1 unrouted)
  Top 0.381: R6.1 70.21,27.13 SW5.P$4
N$15  (1 unrouted)
  Top 0.406: R11.1 7.59,40.44 SW2.P$3
N$16  (1 unrouted)
  Top 0.381: R9.1 68.16,49.64 SW6.P$4
N$17  (1 unrouted)
  Top 0.406: R10.1 30.26,45.72 30.41,45.57 SW4.P$3
N$18  (1 unrouted)
  Top 0.381: R8.1 77.28,50.79 SW8.P$3
N$19  (1 unrouted)
  Top 0.406: R7.1 77.93,28.24 SW7.P$3
N$20
  Top 0.406: D15.0 78.77,41.23 78.7,41.16 R15.1
N$21
  Top 0.381: R16.1 D14.0
N$22
  Top 0.406: R17.1 57.68,42.68 D13.0
N$23
  Top 0.406: D12.0 R18.1
N$24
  Top 0.381: D11.0 47.83,23.01 47.98,22.86 R19.1
N$25
  Top 0.381: D10.0 R20.1
N$26
  Top 0.254: U1.P$8 43.06,37.18 42.98,37.1 C5.1 41.67,36.68 FB2.1
N$29
  Top 0.381: R41.1 D21.0
N$30
  Top 0.406: D22.0 93.29,58.15 R40.1
N$31  (via drill 0.6)
  Top 0.381: 37,32.4 34.6,30 30.2,30 26.8,26.6 26.8,23.4 28.6,21.6 28.89,21.6 D10.1 | Q1.M 38.13,32.47 37.07,32.47 37,32.4 | 36.8,32.22 36.98,32.4 37,32.4 | 16.9,50.5 D5.1 | D14.1 93.83,60.77 93.85,60.75 D22.1 | D9.1 15.86,32.8 10.4,32.8 7.8,30.2 7.8,26.2 3.4,21.8 3.4,20.84 D6.1
  Top 0.406: 16.9,50.5 v17.8,49.6 17.8,43.4 22.2,43.4 24,41.6 24.2,41.6 | D13.1 63.32,42.08 | D11.1 48.48,24.8 43.6,24.8 40.4,28 40.4,30.2 38.13,32.47 | D12.1 74.82,29.2 78.6,29.2 80.2,30.8 81,30.8 | 81,30.8 82.4,32.2 82.4,35.2 79.8,37.8 79.8,43.4 77.08,43.4 D15.1 77.08,41.68 73.8,38.4 67,38.4 63.32,42.08 | D22.1 95.2,60.75 95.2,58.4 94.2,57.4 91,57.4 89.5,55.9 83.34,55.9 82.2,54.76 82.2,50.2 80.6,48.6 73.4,48.6 71.4,46.6 66,46.6 63.32,43.92 63.32,42.08 | D8.1 37.26,39.8 35.6,39.8 34.4,41 28.2,41 25.2,38 25.2,32 21.2,28 v21.2,24.6 21.6,24.2 21.6,22.4 20.8,21.6 19.4,21.6 18.6,22.4 18.6,29.6 19.3,30.3 | 26.8,23.4 v25.2,23.4 | D7.1 25.35,41.6 24.2,41.6 | D9.1 17.86,31.74 19.3,30.3 | 19.3,30.3 19.4,30.2 20.6,30.2 23.4,33 23.4,40.8 24.2,41.6 | D14.1 74.69,61.8 70.2,61.8 67,58.6 60.8,58.6 58.4,56.2 50.6,56.2 49.18,57.62 D4.1 49.18,59.42 47.2,61.4 32.4,61.4 29.6,58.6 29.6,55.8 24.4,50.6 22,50.6 v20.4,52.2 | 81,30.8 81,27.2 85.6,22.6 92,22.6 93.2,23.8 93.2,26.05 D21.1
  Bottom 0.406: v25.2,23.4 22.4,23.4 v21.2,24.6 | v17.8,49.6 20.4,49.6 v20.4,52.2
N$32
  Top 0.508: VR1.P$1 42.14,13.34 42.96,14.16 C17.0
Q1
  Top 0.381: Q1.L 40.42,32.63 R14.0
RESET
  Top 0.254: U1.P$3 43.12,39.68 41.88,40.92
  Top 0.406: R3.0 28.05,44.75 30.6,42.2 35.4,42.2 36.68,40.92 41.88,40.92
RXD
  Top 0.254: U1.P$46 47.44,45.56 45.8,47.2 45.8,51.6 42.4,55 37.19,55 J3.P$2
SW1  (1 unrouted)
  Top 0.254: U1.P$4 42.9,39.18 41.78,40.3 36.3,40.3 35.4,41.2
  Top 0.381: 35.4,41.2 35,41.6 28.4,41.6 | C8.1 7.6,22.92 SW1.P$1
  Top 0.406: SW1.P$2 20.11,28.51 24.2,32.6 24.2,38 27.8,41.6 28.4,41.6
SW2  (1 unrouted)
  Top 0.254: U1.P$2 43.42,40.18 42,41.6 41.2,41.6
  Top 0.381: 31,47 30.48,46.48 28.76,46.48 27.88,45.6 26.8,45.6
  Top 0.406: C15.1 6.38,45.3 6.55,45.47 SW2.P$1 | 41.2,41.6 37.2,41.6 34.4,44.4 34.4,45.2 32.6,47 31,47 | 26.8,45.6 23,45.6 22.87,45.47 SW2.P$2
SW3  (1 unrouted)
  Top 0.254: U1.P$45 47.94,41.54 46.2,39.8 46.2,34.8 44.1,32.7 44.1,31.6
  Top 0.381: C9.1 30.34,27.86 30.5,28.02 SW3.P$1
  Top 0.406: SW3.P$2 44.11,31.59 44.1,31.6
SW4  (1 unrouted)
  Top 0.254: U1.P$48 46.44,44.96 44.11,47.29 SW4.P$2
  Top 0.406: C14.1 31.61,50.58 SW4.P$1
SW5  (1 unrouted)
  Top 0.254: SW5.P$1 52.27,32.13 51.94,32.46 U1.P$24
  Top 0.381: SW5.P$2 69.07,32.13 69.22,31.98 C10.1
SW6  (1 unrouted)
  Top 0.254: 51.8,44.2 51.44,43.84 U1.P$38
  Top 0.381: 54.4,46.8 54.4,50.4 55.61,51.61 SW6.P$1 | C13.1 69.48,54.52 69.32,54.68 SW6.P$2
  Top 0.406: 54.4,46.8 51.8,44.2
SW7  (1 unrouted)
  Top 0.254: 63.2,39.8 62.82,40.18 U1.P$35
  Top 0.381: 67.8,36.8 73.63,36.8 C11.1
  Top 0.406: C11.1 78.48,33.08 78.64,33.24 SW7.P$1 | 67.8,36.8 66.2,36.8 63.2,39.8
SW8  (1 unrouted)
  Top 0.254: U1.P$37 51.94,43.34 52.4,43.8
  Top 0.381: SW8.P$1 79.61,53.01 78.28,51.68 | 66.4,47.8 70.6,47.8
  Top 0.406: C12.1 78.24,55.64 78.4,55.8 SW8.P$1 | 66.4,47.8 65,47.8 62.6,45.4 54,45.4 52.4,43.8 | 70.6,47.8 72.6,49.8 74.8,49.8 76.68,51.68 78.28,51.68
TXD
  Top 0.254: J3.P$1 33.34,55.06 34,54.4 42.2,54.4 45.32,51.28 45.32,46.88 46.94,45.26 U1.P$47
VDD
  Top 0.762: J2.P$1 63.79,13.39 61.2,10.8 59.4,10.8 59.29,10.69 F1.P$1
XJOY
  Top 0.381: U$1.P$2 82,16.74 82,19.4 81.12,20.28 R23.1
XTALIN
  Top 0.203: 37.42,38.18 U1.P$6
  Top 0.254: 37.42,38.18 34,38.18 34,39.8 32.12,39.8 C4.1
  Top 0.406: C4.1 29.19,39.38 X1.P$2
XTALOUT
  Top 0.203: U1.P$7 38.28,37.68 37.8,37.2
  Top 0.381: 37.8,37.2 34.82,34.22 C3.1 X1.P$1
YJOY
  Top 0.381: U$1.P$5 88,16.59 88,19.6 88.68,20.28 R24.1
ZJOY
  Top 0.381: R25.1 83.43,20.12 U$1.P$8

### Text on the board
bPlace: Usewood / CAN keypad driver / Left Rev 1.0 | CANH | GND | VDD | CANL | CAN | JOYSTICK